# EAGLE design VF_MDS_PCB (EAGLE 9.6.2)
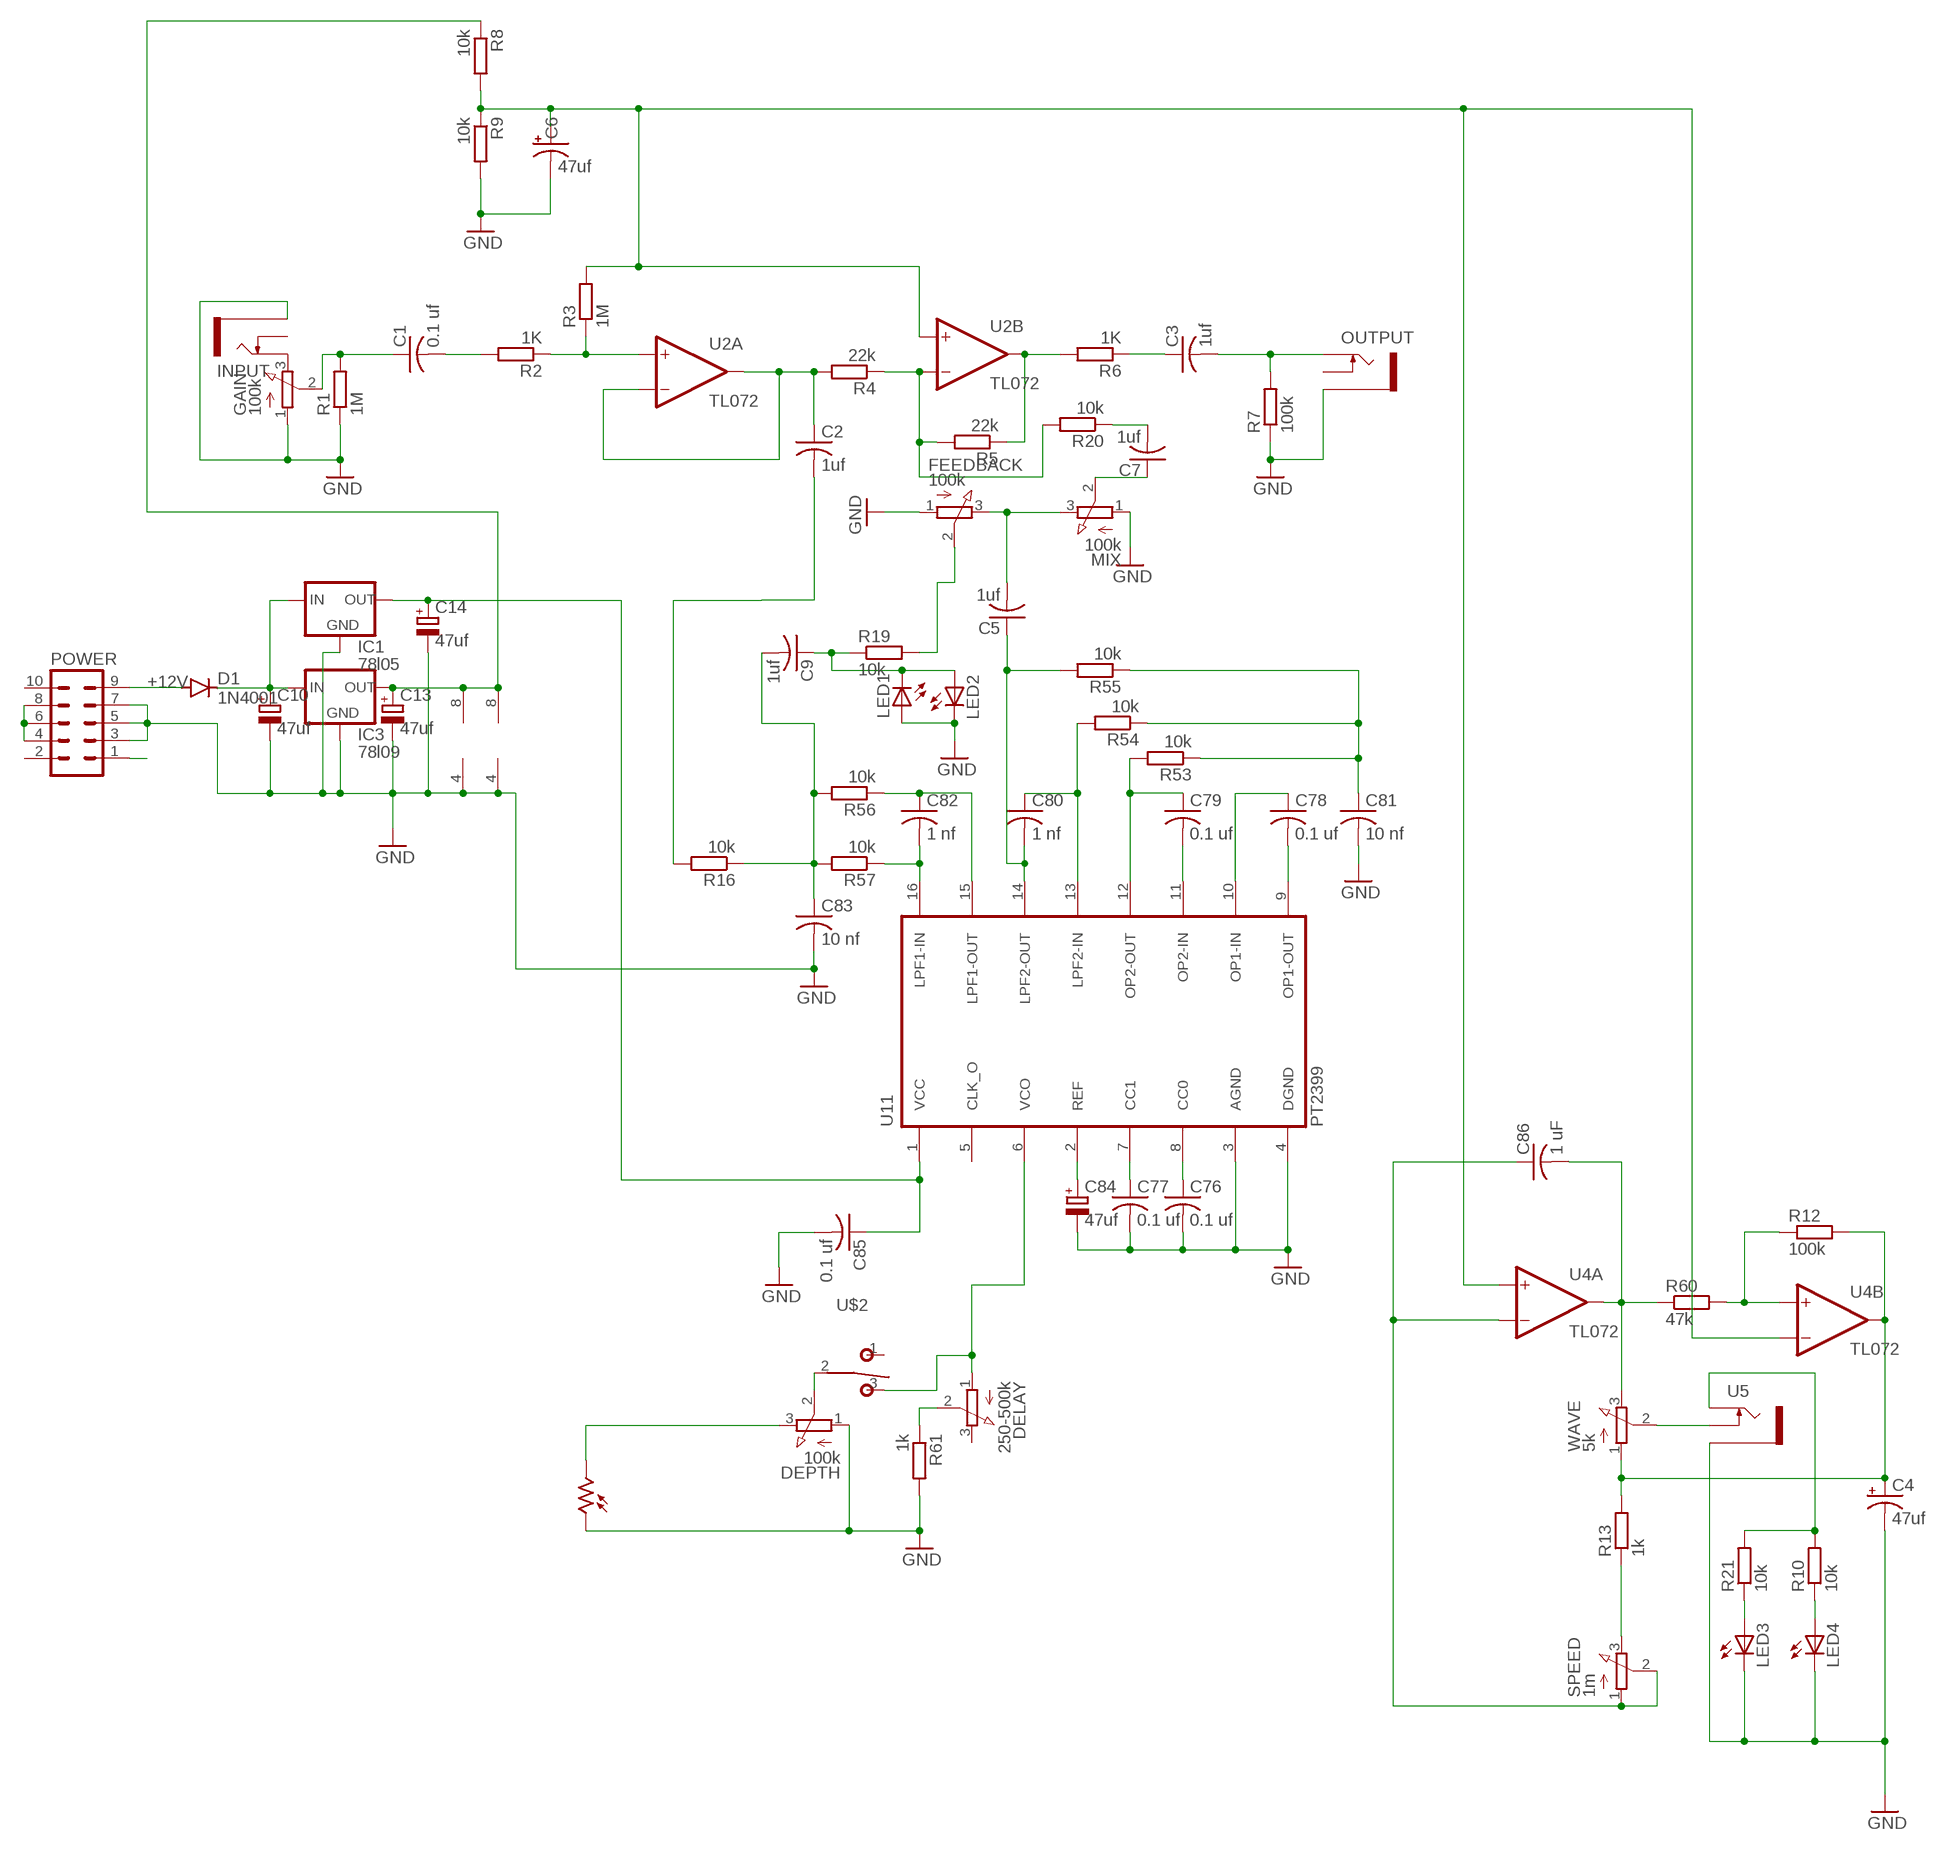
[diagram p0: schematic, sheet 1]

## Parts
C1  0.1 uf  C-US050-025X075  [C050-025X075]
C2  1uf  C-US050-025X075  [C050-025X075]
C3  1uf  C-US050-025X075  [C050-025X075]
C4  47uf  CPOL-USE2,5-6E  [E2,5-6E]
C5  1uf  C-US050-025X075  [C050-025X075]
C6  47uf  CPOL-USE2,5-6E  [E2,5-6E]
C7  1uf  C-US050-025X075  [C050-025X075]
C9  1uf  C-US050-025X075  [C050-025X075]
C10  47uf  CPOL-EUE2,5-6E  [E2,5-6E]
C13  47uf  CPOL-EUE2,5-6E  [E2,5-6E]
C14  47uf  CPOL-EUE2,5-6E  [E2,5-6E]
C76  0.1 uf  C-US050-025X075  [C050-025X075]
C77  0.1 uf  C-US050-025X075  [C050-025X075]
C78  0.1 uf  C-US050-025X075  [C050-025X075]
C79  0.1 uf  C-US050-025X075  [C050-025X075]
C80  1 nf  C-US050-025X075  [C050-025X075]
C81  10 nf  C-US050-025X075  [C050-025X075]
C82  1 nf  C-US050-025X075  [C050-025X075]
C83  10 nf  C-US050-025X075  [C050-025X075]
C84  47uf  CPOL-EUE2,5-6E  [E2,5-6E]
C85  0.1 uf  C-US050-025X075  [C050-025X075]
C86  1 uF  C-US050-025X075  [C050-025X075]
D1  1N4001  1N4004  [DO41-10]
DELAY  250-500k  EVUF2L  [EVUFXL]
DEPTH  100k  EVUF2L  [EVUFXL]
FEEDBACK  100k  EVUF2L  [EVUFXL]
GAIN  100k  EVUF2L  [EVUFXL]
IC1  78l05  78LXX  [78LXX]
IC3  78l09  78LXX  [78LXX]
INPUT  THONKICONNNEW  [WQP-PJ301M-12_JACK]
LED1  LED3MM  [LED3MM]
LED2  LED3MM  [LED3MM]
LED3  LED5MM  [LED5MM]
LED4  LED5MM  [LED5MM]
MIX  100k  EVUF2L  [EVUFXL]
OUTPUT  THONKICONNNEW  [WQP-PJ301M-12_JACK]
PH5  VT90N1  [VT900]
POWER  10_PIN_HEADER  [MA05-2]
R1  1M  RESISTOR7MM  [7MM_RESISTOR]
R2  1K  RESISTOR7MM  [7MM_RESISTOR]
R3  1M  RESISTOR7MM  [7MM_RESISTOR]
R4  22k  RESISTOR7MM  [7MM_RESISTOR]
R5  22k  RESISTOR7MM  [7MM_RESISTOR]
R6  1K  RESISTOR7MM  [7MM_RESISTOR]
R7  100k  RESISTOR7MM  [7MM_RESISTOR]
R8  10k  RESISTOR7MM  [7MM_RESISTOR]
R9  10k  RESISTOR7MM  [7MM_RESISTOR]
R10  10k  RESISTOR7MM  [7MM_RESISTOR]
R12  100k  RESISTOR7MM  [7MM_RESISTOR]
R13  1k  RESISTOR7MM  [7MM_RESISTOR]
R16  10k  RESISTOR7MM  [7MM_RESISTOR]
R19  10k  RESISTOR7MM  [7MM_RESISTOR]
R20  10k  RESISTOR7MM  [7MM_RESISTOR]
R21  10k  RESISTOR7MM  [7MM_RESISTOR]
R53  10k  RESISTOR7MM  [7MM_RESISTOR]
R54  10k  RESISTOR7MM  [7MM_RESISTOR]
R55  10k  RESISTOR7MM  [7MM_RESISTOR]
R56  10k  RESISTOR7MM  [7MM_RESISTOR]
R57  10k  RESISTOR7MM  [7MM_RESISTOR]
R60  47k  RESISTOR7MM  [7MM_RESISTOR]
R61  1k  RESISTOR7MM  [7MM_RESISTOR]
SPEED  1m  EVUF2L  [EVUFXL]
U2  TL072  [DIL08-SML]
U4  TL072  [DIL08-SML]
U5  THONKICONNNEW  [WQP-PJ301M-12_JACK]
U11  PT2399  [DIL16]
U$2  T-80-T-SPDT-ON-OFF-ON  [M9040P]
WAVE  5k  EVUF2L  [EVUFXL]

## Nets
+12V [power]: C10.+ D1.C IC1.IN IC3.IN
-12V [power]: POWER.1
GND: C4.- C6.- C10.- C13.- C14.- C76.2 C77.2 C81.2 C83.2 C84.- C85.2 DEPTH.1(A) FEEDBACK.1(A) GAIN.1(A) IC1.GND IC3.GND INPUT.P$3_SLEEVE(SLEEVE) LED1.A LED2.K(C) LED3.K(C) LED4.K(C) MIX.1(A) OUTPUT.P$3_SLEEVE(SLEEVE) PH5.1 POWER.3 POWER.5 POWER.7 R1.1 R7.1 R9.2 R61.2 U2.4(P:V-) U4.4(P:V-) U5.P$3_SLEEVE(SLEEVE) U11.3(AGND) U11.4(DGND)
GND2: POWER.4 POWER.6 POWER.8
N$1: C1.1 GAIN.2(S) R1.2
N$2: C1.2 R2.2
N$3: R2.1 R3.1 U2.3(A:+IN)
N$4: C2.1 R4.2 U2.1(A:OUT) U2.2(A:-IN)
N$5: R4.1 R5.2 R20.2 U2.6(B:-IN)
N$6: R5.1 R6.2 U2.7(B:OUT)
N$7: C3.2 OUTPUT.P$1_TIP(TIP) R7.2
N$8: C3.1 R6.1
N$9: DELAY.2(S) R61.1
N$10: C6.+ R3.2 R8.2 R9.1 U2.5(B:+IN) U4.3(A:+IN) U4.6(B:-IN)
N$11: DEPTH.2(S) U$2.2(P)
N$12: DEPTH.3(E) PH5.2
N$13: C86.2 R60.1 U4.1(A:OUT) WAVE.3(E)
N$14: R12.1 R60.2 U4.5(B:+IN)
N$15: R13.1 SPEED.3(E)
N$16: C4.+ R12.2 R13.2 U4.7(B:OUT) WAVE.1(A)
N$17: C86.1 SPEED.1(A) SPEED.2(S) U4.2(A:-IN)
N$18: GAIN.3(E) INPUT.P$1_TIP(TIP)
N$19: C5.2 FEEDBACK.3(E) MIX.3(E)
N$20: C7.2 R20.1
N$21: FEEDBACK.2(S) R19.2
N$22: C7.1 MIX.2(S)
N$23: C9.1 LED1.K(C) LED2.A R19.1
N$24: C9.2 C83.1 R16.1 R56.2 R57.2
N$25: U5.P$2_SWITCH(SWITCH) WAVE.2(S)
N$26: R10.2 R21.2 U5.P$1_TIP(TIP)
N$27: C2.2 R16.2
N$28: LED3.A R21.1
N$29: C13.+ IC3.OUT R8.1 U2.8(P:V+) U4.8(P:V+)
N$30: D1.A POWER.9
N$31: LED4.A R10.1
N$32: C14.+ C85.1 IC1.OUT U11.1(VCC)
N$40: DELAY.1(A) U11.6(VCO) U$2.3(S)
N$120: C76.1 U11.8(CC0)
N$121: C77.1 U11.7(CC1)
N$122: C78.2 U11.9(OP1-OUT)
N$123: C78.1 U11.10(OP1-IN)
N$124: C79.2 U11.11(OP2-IN)
N$125: C79.1 R53.2 U11.12(OP2-OUT)
N$126: C5.1 C80.2 R55.2 U11.14(LPF2-OUT)
N$127: C80.1 R54.2 U11.13(LPF2-IN)
N$128: C81.1 R53.1 R54.1 R55.1
N$129: C82.2 R57.1 U11.16(LPF1-IN)
N$130: C82.1 R56.1 U11.15(LPF1-OUT)
N$131: C84.+ U11.2(REF)
Unconnected: DELAY.3(E) INPUT.P$2_SWITCH(SWITCH) OUTPUT.P$2_SWITCH(SWITCH) POWER.2 POWER.10 U11.5(CLK_O) U$2.1(O)

## Library data of the parts
C1-C3 C5 C7 C9 C76-C83 C85 C86 = rcl:C-US: CAPACITOR, American symbol; SPICEPREFIX: C
C4 C6 = rcl:CPOL-US: POLARIZED CAPACITOR, American symbol; SPICEPREFIX: C
C10 C13 C14 C84 = rcl:CPOL-EU: POLARIZED CAPACITOR, European symbol; SPICEPREFIX: C
D1 = diode:1N4004: DIODE general purpose rectifier, 1 A
DELAY DEPTH FEEDBACK GAIN MIX SPEED WAVE = pot:EVU: 9 mm Square Rotary Potentiometers Source: Panasonic
IC1 IC3 = v-reg:78LXX: VOLTAGE REGULATOR
INPUT OUTPUT U5 = MusicThingModular:THONKICONN: 3.5mm socket for Eurorack modular synths
LED1-LED4 = led:LED: LED OSRAM: - CHIPLED LG R971, LG N971, LY N971, LG Q971, LY Q971, LO R971, LY R971 LH N974, LH R974 LS Q976, LO Q976, LY Q976 LO Q996 - Hyper CHIPLED LW Q18S LB Q993, LB Q99A, LB R99A - SideLED LS A670, LO A670, LY A670, LG A670, LP A670 LB A673, LV A673, LT A673, LW A673 LH A674 LY A675 LS A676, LA A676, LO A676, LY A676, LW A676 LS A679, LY A679, LG A679 - Hyper Micro SIDELED® LS Y876, LA Y876, LO Y876, LY Y876 LT Y87S - SmartLED LW L88C, LW L88S LB L89C, LB L89S, LG L890 LS L89K, LO L89K, LY L89K LS L896, LA L896, LO L896, LY L896 - TOPLED LS T670, LO T670, LY T670, LG T670, LP T670 LSG T670, LSP T670, LSY T670, LOP T670, LYG T670 LG T671, LOG T671, LSG T671 LB T673, LV T673, LT T673, LW T673 LH T674 LS T676, LA T676, LO T676, LY T676, LB T676, LH T676, LSB T676, LW T676 LB T67C, LV T67C, LT T67C, LS T67K, LO T67K, LY T67K, LW E67C LS E67B, LA E67B, LO E67B, LY E67B, LB E67C, LV E67C, LT E67C LW T67C LS T679, LY T679, LG T679 LS T770, LO T770, LY T770, LG T770, LP T770 LB T773, LV T773, LT T773, LW T773 LH T774 LS E675, LA E675, LY E675, LS T675 LS T776, LA T776, LO T776, LY T776, LB T776 LHGB T686 LT T68C, LB T68C - Hyper Mini TOPLED® LB M676 - Mini TOPLED Santana® LG M470 LS M47K, LO M47K, LY M47K Source: http://www.osram.convergy.de LUXEON: - LUMILED® LXK2-PW12-R00, LXK2-PW12-S00, LXK2-PW14-U00, LXK2-PW14-V00 LXK2-PM12-R00, LXK2-PM12-S00, LXK2-PM14-U00 LXK2-PE12-Q00, LXK2-PE12-R00, LXK2-PE12-S00, LXK2-PE14-T00, LXK2-PE14-U00 LXK2-PB12-K00, LXK2-PB12-L00, LXK2-PB12-M00, LXK2-PB14-N00, LXK2-PB14-P00, LXK2-PB14-Q00 LXK2-PR12-L00, LXK2-PR12-M00, LXK2-PR14-Q00, LXK2-PR14-R00 LXK2-PD12-Q00, LXK2-PD12-R00, LXK2-PD12-S00 LXK2-PH12-R00, LXK2-PH12-S00 LXK2-PL12-P00, LXK2-PL12-Q00, LXK2-PL12-R00 Source: www.luxeon.com KINGBRIGHT: KA-3528ASYC Source: www.kingbright.com
PH5 = photo-elements:VT9: Photoconductive Cell VT900 Series Source: http://optoelectronics.perkinelmer.com/content/Datasheets/DTS_vt900seriesdatasheet.pdf
POWER = TomW:10_PIN_HEADER: PIN HEADER; OC_FARNELL: unknown; OC_NEWARK: unknown
R1-R10 R12 R13 R16 R19-R21 R53-R57 R60 R61 = MusicThingModular:RESISTOR: Standard resistor, various versions
U2 U4 = MusicThingModular:TL072: Generic Dual Op Amp
U11 = princeton-tech:PT2399: Echo Processor IC
U$2 = MusicThingModular:T-80-T-SPDT-ON-OFF-ON

## Net classes
1 power: width 0.61 mm

## Board
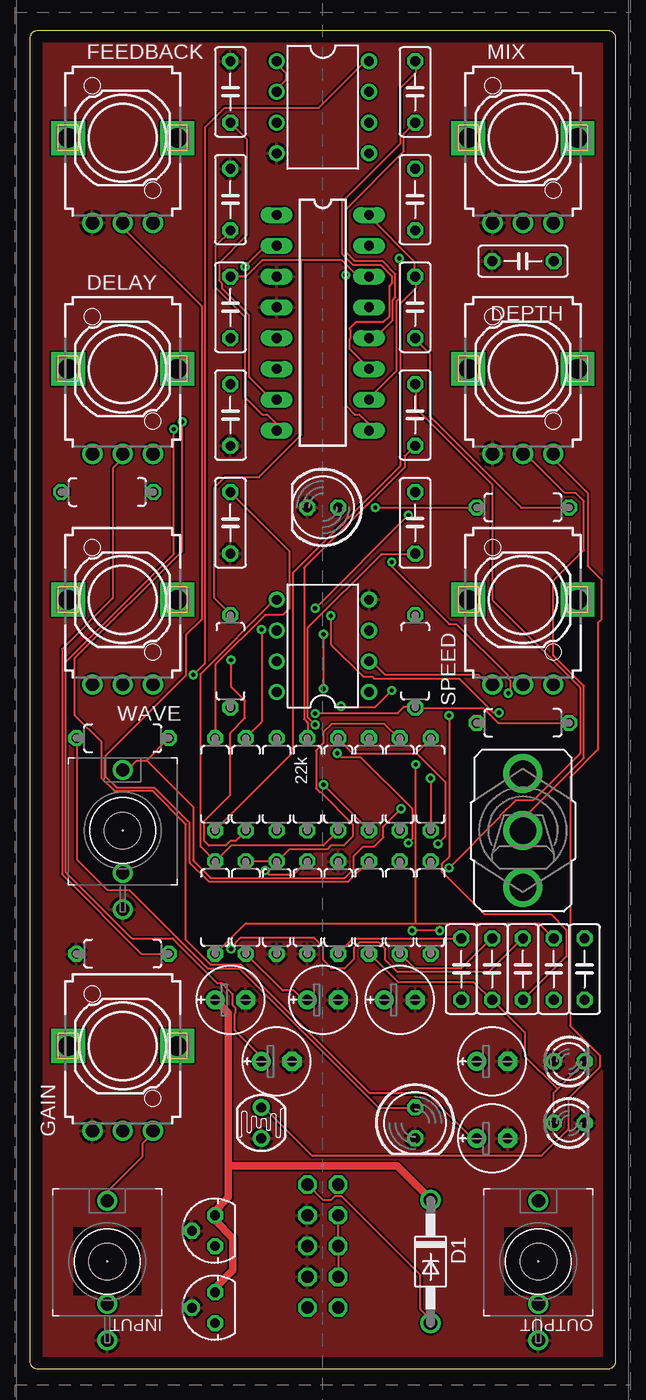
[diagram p1: board, top side]
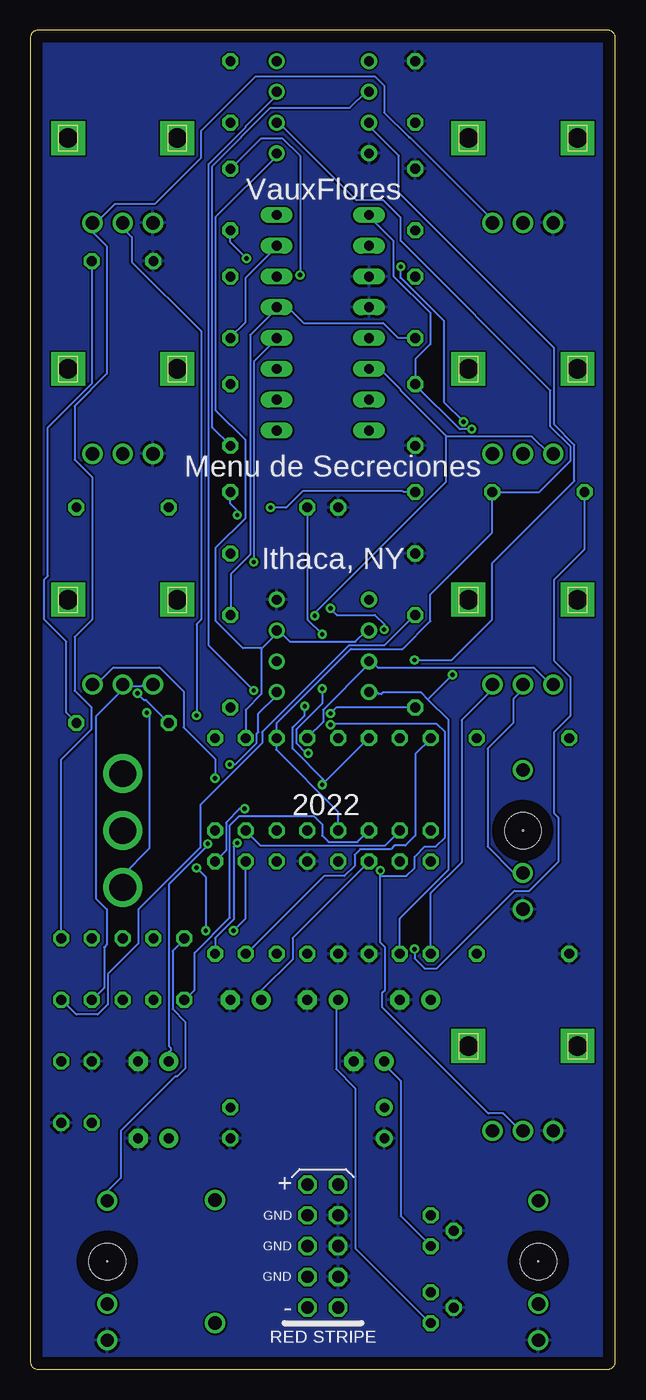
[diagram p2: board, bottom side, seen from below]

Size 48.26 x 110.49 mm. Coordinates in mm from the lower left corner, seen from the top.
Copper layers (1*16): Top 0.035mm / dielectric 1.5mm / Bottom 0.035mm
Design rules "default": minimum track width 6mil, minimum drill 0.35mm, track to track 6mil, track to pad 6mil, pad to pad 6mil, via to via 6mil, smd to smd 6mil, copper to edge 40mil, drill to drill 6mil, minimum pad ring 10mil, minimum via ring 8mil, stop-mask expansion 4mil, vias tented up to drill 0mil, thermal gap 10mil
Holes 0.08 mm at 7.62,44.45 41.91,8.89 6.35,8.89
Holes 3 mm at 6.35,8.89 41.91,8.89 7.62,44.45

### Footprints (pad centres in the part's own frame; a part is rotated, then mirrored left to right if it is on the bottom)
C050-025X075 = drill 0.813 octagon: 1 -2.54,0; 2 2.54,0
E2,5-6E = drill 0.813 pad 1.575: + -1.27,0 | drill 0.813 pad 1.575 octagon: - 1.27,0
DO41-10 = drill 1.118: A 5.08,0; C -5.08,0
EVUFXL = drill 1.1 pad 1.676: 1 -2.5,-7; 2 0,-7; 3 2.5,-7 | drill 1.6 pad 2.8 square: M1 4.5,0; M2 -4.5,0
78LXX = drill 0.813 octagon: GND 0,1.905; IN 1.27,0; OUT -1.27,0
WQP-PJ301M-12_JACK = drill 1.1: P$1_TIP 0,5; P$2_SWITCH 0,-3.5; P$3_SLEEVE 0,-6.5
LED3MM = drill 0.813 octagon: A -1.27,0; K 1.27,0
LED5MM = drill 0.813 octagon: A -1.27,0; K 1.27,0
VT900 = drill 0.8 pad 1.4: 1 -1.27,0; 2 1.27,0
MA05-2 = drill 1.016 octagon: 1 -5.08,-1.27; 2 -5.08,1.27; 3 -2.54,-1.27; 4 -2.54,1.27; 5 0,-1.27; 6 0,1.27; 7 2.54,-1.27; 8 2.54,1.27; 9 5.08,-1.27; 10 5.08,1.27
7MM_RESISTOR = drill 0.813 octagon: 1 -3.81,0; 2 3.81,0
DIL08-SML = drill 0.813 pad 1.27: 1 -3.81,-3.81; 2 -1.27,-3.81; 3 1.27,-3.81; 4 3.81,-3.81; 5 3.81,3.81; 6 1.27,3.81; 7 -1.27,3.81; 8 -3.81,3.81
DIL16 = drill 0.813 long: 1 -8.89,-3.81; 2 -6.35,-3.81; 3 -3.81,-3.81; 4 -1.27,-3.81; 5 1.27,-3.81; 6 3.81,-3.81; 7 6.35,-3.81; 8 8.89,-3.81; 9 8.89,3.81; 10 6.35,3.81; 11 3.81,3.81; 12 1.27,3.81; 13 -1.27,3.81; 14 -3.81,3.81; 15 -6.35,3.81; 16 -8.89,3.81
M9040P = drill 2.2: 1 0,4.699 | drill 2.2 pad 3: 2 0,0; 3 0,-4.699

### Placement (x,y rotation side)
C1  31.75,69.85 90 top
C2  31.75,78.74 90 top
C3  35.56,33.02 90 top
C4  38.1,25.4 0 top
C5  45.72,33.02 90 top
C6  30.48,30.48 0 top
C7  40.64,33.02 90 top
C9  38.1,33.02 90 top
C10  16.51,30.48 0 top
C13  24.13,30.48 0 top
C14  20.32,25.4 0 top
C76  16.51,96.52 90 top
C77  16.51,105.41 90 top
C78  31.75,96.52 90 top
C79  31.75,105.41 90 top
C80  16.51,87.63 90 top
C81  40.64,91.44 180 top
C82  31.75,87.63 90 top
C83  16.51,69.85 270 top
C84  38.1,19.05 0 top
C85  16.51,78.74 270 top
C86  43.18,33.02 90 top
D1  33.02,8.89 270 top
DELAY  7.62,82.55 0 top
DEPTH  40.64,82.55 0 top
FEEDBACK  7.62,101.6 0 top
GAIN  7.62,26.67 0 top
IC1  15.24,11.43 90 top
IC3  15.24,5.08 90 top
INPUT  6.35,8.89 0 top
LED1  44.45,25.4 0 top
LED2  44.45,20.32 0 top
LED3  31.75,20.32 270 top
LED4  24.13,71.12 180 top
MIX  40.64,101.6 0 top
OUTPUT  41.91,8.89 0 top
PH5  19.05,20.32 90 top
POWER  24.13,10.16 90 bottom
R1  22.86,38.1 90 top
R2  17.78,48.26 90 top
R3  30.48,48.26 90 top
R4  22.86,48.26 90 top
R5  27.94,48.26 90 top
R6  20.32,48.26 90 top
R7  25.4,38.1 270 top
R8  17.78,38.1 90 top
R9  20.32,38.1 270 top
R10  33.02,38.1 90 top
R12  25.4,48.26 90 top
R13  33.02,48.26 90 top
R16  30.48,38.1 90 top
R19  27.94,38.1 90 top
R20  6.35,72.39 0 top
R21  7.62,52.07 0 top
R53  40.64,53.34 180 top
R54  31.75,58.42 90 top
R55  16.51,58.42 90 top
R56  40.64,71.12 180 top
R57  15.24,48.26 90 top
R60  15.24,38.1 90 top
R61  7.62,34.29 180 top
SPEED  40.64,63.5 0 top
U2  24.13,104.14 270 top
U4  24.13,59.69 90 top
U5  7.62,44.45 0 top
U11  24.13,86.36 270 top
U$1  [EURO_PCB_10HP]  -1.27,-8.89 0 top  (outside the outline)
U$2  40.64,44.45 0 top
WAVE  7.62,63.5 0 top

### Tracks (layer width: path | path; a pad name or v marks a point on that pad's centre or on a via)
+12V
  Top 0.61: IC3.IN 15.27,6.4 15.27,6.71 16.71,8.15 16.71,10.82 15.27,12.27 15.27,12.65 IC1.IN 15.11,12.95 16.33,14.17 16.33,16.76 | 16.33,16.76 16.33,29.41 15.27,30.48 C10.+ | 16.33,16.76 30.28,16.76 33.02,14.02 D1.C
GND
  pour Top: 0,110.49 49.53,110.49 49.53,-1.27 -1.27,-1.27 -1.27,110.49
  pour Bottom: 0,110.49 48.26,110.49 48.26,0 0,0
GND2
  Top 0.152: POWER.4 POWER.6 POWER.8
N$1  (via drill 0.35)
  Top 0.152: v19.38,41.15 19.68,40.84 21.74,40.84 22.81,41.91 R1.2 | v23.5,53.19 22.89,53.8 22.89,61.19 28.98,67.28 31.72,67.28 C1.1
  Bottom 0.152: 19.38,40.69 19.38,35.2 19,34.82 19,31.32 19.23,31.09 19.23,29.87 10.46,21.11 9.25,21.11 7.87,19.74 7.64,19.74 GAIN.2 | 19.38,40.69 v19.38,41.15 | v23.5,53.19 23.42,53.26 14.73,53.26 14.05,52.58 14.05,43.89 14.81,43.13 15.72,43.13 16.56,42.29 16.56,41.38 17.25,40.69 19.38,40.69
N$2  (via drill 0.35)
  Top 0.152: v19.07,61.04 19.07,53.42 17.78,52.12 R2.2 | v31.19,70.48 v23.5,62.79
  Bottom 0.152: v19.07,61.04 19.07,61.49 19.84,62.26 22.96,62.26 v23.5,62.79 | v31.19,70.48 31.19,70.87 31.8,71.48 31.8,72.39 C1.2
N$3  (via drill 0.35)
  Top 0.152: v16.56,58.52 16.56,56.31 17.7,55.17 17.7,53.72 16.48,52.5 16.48,47.4 14.35,45.26 14.35,43.59 14.73,43.2 16.1,43.2 16.48,43.59 16.94,43.59 17.78,44.42 R2.1
  Bottom 0.152: R2.1 17.78,44.42 19,43.2 29.29,43.2 30.5,44.42 R3.1 | v16.56,58.52 13.51,58.52 10.16,61.87 10.16,66.52 3.38,73.3 3.38,76.28 5.05,77.95 5.05,84.28 17.86,97.08 17.86,100.13 20.3,102.56 20.3,102.87 U2.3
N$4
  Top 0.152: U2.2 20.37,105.46 20.37,105.69 21.06,106.38 21.06,106.98 20.37,107.67 20.37,107.9 U2.1 | R4.2 22.89,52.12 22.89,53.34 22.58,53.65 22.58,66.14 30.89,74.45 30.89,75.36 31.72,76.2 C2.1
  Bottom 0.152: U2.2 20.37,105.39 20.6,105.39 21.89,104.09 28.45,104.09 33.25,99.29 33.25,77.72 31.72,76.2 C2.1
N$5
  Bottom 0.152: R4.1 22.89,44.5 22.89,46.02 27.99,51.13 27.99,52.05 R5.2 27.91,52.12 27.91,53.34 21.82,59.44 17.55,59.44 15.27,61.72 15.27,63.93 10.16,69.04 R20.2 6.27,72.39 3.68,74.98 3.68,76.12 5.36,77.8 5.36,80.77 17.7,93.12 17.7,95.02 19.15,96.47 21.36,96.47 27.76,102.87 U2.6
N$6  (via drill 0.35)
  Top 0.152: v24.18,48.23 27.91,44.5 R5.1 | v29.82,56.01 28.45,54.63 25.71,54.63 v25.63,54.71
  Bottom 0.152: R6.2 20.37,52.05 v24.18,48.23 23.95,48.54 26.62,51.21 26.62,52.96 25.63,53.95 v25.63,54.71 | v29.82,56.01 33.55,59.74 33.55,99.44 30.5,102.49 30.5,102.56 27.99,105.08 27.99,105.39 U2.7
N$7
  Top 0.152: R7.2 26.62,35.51 35.53,35.51 C3.2
  Bottom 0.152: OUTPUT.P$1_TIP 41.86,13.95 41.86,14.71 40.79,15.77 40.79,19.66 36.3,24.16 36.14,24.16 35.46,24.84 35.46,28.65 36.52,29.72 36.52,34.52 35.53,35.51 C3.2
N$8
  Bottom 0.152: R6.1 20.37,44.42 21.29,43.51 23.65,43.51 24.18,44.04 24.18,44.96 24.87,45.64 31.04,45.64 31.8,44.88 31.8,37.26 34.7,34.37 34.7,31.32 35.53,30.48 C3.1
N$9
  Top 0.152: R61.1 9.17,34.29 2.62,40.84 2.62,59.44 6.81,63.63 6.81,74.37 7.57,75.13 7.57,75.51 DELAY.2
N$10
  Top 0.152: R8.2 R9.1 20.37,41.91 21.36,42.9 24.49,42.9 24.79,43.2 25.86,43.2 26.62,43.97 26.62,44.96 23.95,47.62 23.88,47.62 23.57,47.93 23.57,51.05 24.18,51.66 24.18,52.58 24.87,53.26 29.21,53.26 30.43,52.05 R3.2
  Bottom 0.152: C6.+ 29.21,31.24 26.62,33.83 26.62,35.59 20.3,41.91 R9.1 | U4.6 20.52,60.96 21.44,60.05 26.85,60.05 27.76,60.96 U4.3 27.76,60.88 29.17,59.47 | 29.17,59.47 29.21,59.44 29.21,55.7 30.5,54.41 30.5,52.12 R3.2 | U2.5 27.99,100.28 27.99,100.05 32.94,95.1 32.94,79.1 30.5,76.66 30.5,70.26 32.94,67.82 32.94,61.72 30.73,59.51 29.21,59.51 29.17,59.47
N$11
  Top 0.152: U$2.2 40.64,45.41 45.67,50.44 45.67,56.39 43.15,58.9 43.15,65.08 45.67,67.59 45.67,71.63 44.98,72.31 44.07,72.31 40.87,75.51 40.64,75.51 DEPTH.2
N$12
  Top 0.152: PH5.2 19.07,21.57 19.3,21.57 23.27,17.6 42.16,17.6 44.37,19.81 44.37,22.33 46.96,24.92 46.96,25.91 44.53,28.35 44.53,48.84 46.81,51.13 46.81,61.57 47.12,61.87 47.12,65.15 45.97,66.29 45.97,72.31 43.15,75.13 43.15,75.51 DEPTH.3
N$13  (via drill 0.35)
  Top 0.152: C86.2 41.93,36.8 31.8,36.8 | 31.8,36.8 17.78,36.8 15.27,34.29 R60.1 | 31.8,36.8 v31.8,49.91
  Bottom 0.152: R60.1 15.27,34.29 15.27,39.24 12.68,41.83 12.68,53.57 10.16,56.08 10.16,56.46 WAVE.3 | v31.8,49.91 31.34,49.91 29.59,51.66 29.59,52.43 29.44,52.58 29.44,54.1 27.99,55.55 27.99,55.85 U4.1
N$14
  Top 0.152: 15.27,41.91 16.56,43.2 24.18,43.2 25.4,44.42 R12.1 | 15.27,41.91 14.05,43.13 14.05,57.38 20.14,63.48 20.3,63.48 U4.5 | 15.27,41.91 R60.2
N$15  (via drill 0.35)
  Top 0.152: v33.02,48.77 R13.1
  Bottom 0.152: v33.02,48.77 33.02,50.37 35.61,52.96 35.61,55.93 37.59,57.91 41.4,57.91 42.77,56.54 43.08,56.54 SPEED.3
N$16  (via drill 0.35)
  Top 0.152: 31.84,50.86 31.8,50.83 26.62,50.83 25.4,52.05 R12.2 | 31.84,50.86 33.02,52.05 R13.2 | v33.63,43.36 34.24,43.97 34.24,48.46 31.84,50.86
  Bottom 0.152: 20.37,58.14 24.11,54.41 24.11,53.42 25.4,52.12 R12.2 | 20.37,58.14 20.37,58.37 U4.7 20.37,58.14 | C4.+ 36.83,26.14 36.68,26.29 36.68,26.52 36.83,26.67 36.83,40.01 33.63,43.2 v33.63,43.36 | 20.37,58.14 19.84,58.14 19.61,57.91 6.73,57.91 5.36,56.54 5.13,56.54 WAVE.1
N$17
  Top 0.152: U4.2 27.99,58.37 28.22,58.37 29.29,57.3 36.98,57.3 37.74,56.54 38.12,56.54 SPEED.1
  Bottom 0.152: 40.64,56.39 SPEED.2 40.64,56.46 | 40.64,56.39 40.64,56.08 42.85,53.87 42.85,38.86 41.93,37.95 41.93,35.05 42.16,34.82 42.16,31.47 43.15,30.48 C86.1 | 40.64,56.39 39.04,56.39 38.96,56.46 38.2,56.46 SPEED.1
N$18
  Top 0.152: INPUT.P$1_TIP 6.35,14.63 9.25,17.53 9.25,18.59 10.08,19.43 10.08,19.66 GAIN.3
N$19
  Bottom 0.152: C5.2 45.74,35.59 45.74,50.29 43.23,52.81 43.23,54.63 44.6,56.01 44.6,60.43 43.15,61.87 43.15,73.61 44.6,75.06 44.6,79.48 41.93,82.14 41.93,92.66 43.08,93.8 43.08,94.56 MIX.3 43,94.56 42.85,94.56 41.25,96.16 37.97,96.16 34.16,99.97 34.16,102.18 29.67,106.68 19.84,106.68 19.07,105.92 19.07,103.71 17.02,101.65 16.94,101.65 10.16,94.87 10.16,94.64 FEEDBACK.3
N$20  (via drill 0.35)
  Top 0.152: v16.56,34.67 16.56,34.82 17.32,35.59 23.42,35.59 24.18,34.82 24.18,33.76 24.87,33.07 25.93,33.07 26.7,33.83 26.7,34.75 27.15,35.2 28.75,35.2 29.29,34.67 29.29,33.76 30.28,32.77 37.82,32.77 40.64,35.59 C7.2
  Bottom 0.152: R20.1 2.54,67.67 5.05,65.15 5.05,58.45 3.68,57.07 3.68,53.95 5.05,52.58 5.05,45.87 4.67,45.49 4.67,41.91 7.11,39.47 8.33,39.47 14.73,33.07 15.72,33.07 16.56,33.91 v16.56,34.67
N$21
  Top 0.152: R19.2 27.91,41.91 26.24,40.23 14.73,40.23 13.13,41.83 13.13,45.11 10.24,48.01 7.11,48.01 6.2,48.92 6.2,50.6 12.83,57.23 12.83,60.58 14.12,61.87 14.12,87.71 7.64,94.18 7.64,94.56 FEEDBACK.2
N$22  (via drill 0.35)
  Top 0.152: C7.1 44.22,34.06 44.22,36.27 42.93,37.57 37.44,37.57 33.93,41.07 33.93,41.68 34.54,42.29 v34.54,53.95
  Bottom 0.152: v34.54,53.95 34.54,61.49 34.16,61.87 34.16,85.65 39.88,91.36 39.88,93.42 40.64,94.18 MIX.2
N$23
  Top 0.152: 43.5,23.13 45.74,25.38 LED1.K | 43.5,23.13 43.15,22.78 43.15,20.34 LED2.A | R19.1 27.99,34.29 30.35,31.93 36.6,31.93 38.05,30.48 C9.1 38.12,30.48 40.79,27.81 40.79,25.83 43.5,23.13
N$24  (via drill 0.35)
  Top 0.152: R16.1 30.5,34.29 31.72,33.07 35.53,33.07 38.05,35.59 C9.2 | R57.2 15.27,52.12 15.27,58.14 19.38,62.26 20.83,62.26 21.36,62.79 21.36,67.51 16.48,72.39 C83.1 | v28.45,71.09 36.83,71.09 R56.2
  Bottom 0.152: v28.45,71.09 27.15,71.09 25.78,72.47 17.55,72.47 17.48,72.39 C83.1 | R16.1 30.43,34.29 24.03,40.69 22.35,40.69 21.51,41.53 21.51,42.44 21.06,42.9 18.54,42.9 18.24,43.2 17.32,43.2 16.48,44.04 16.48,50.75 15.19,52.05 R57.2
N$25
  Bottom 0.152: U5.P$2_SWITCH 7.64,41 8.41,41 10.54,43.13 10.54,51.21 8.41,53.34 8.41,55.32 7.64,56.08 7.64,56.46 WAVE.2
N$26  (via drill 0.35)
  Top 0.152: 9.59,50.25 9.55,50.22 8.79,50.22 8.03,49.45 7.64,49.45 U5.P$1_TIP | 9.59,50.25 11.38,52.05 R21.2 | v30.58,46.25 29.13,44.81 29.13,43.89 28.37,43.13 27.46,43.13 26.7,42.37 26.7,41.3 25.93,40.54 14.88,40.54 13.44,41.99 13.44,46.41 9.59,50.25
  Bottom 0.152: R10.2 32.11,42.82 32.11,45.11 30.96,46.25 v30.58,46.25
N$27  (via drill 0.35)
  Top 0.152: v33.78,36.2 v31.5,36.2 | v34.54,41.38 38.73,45.57 38.73,45.64 40.03,46.94 41.48,46.94 45.36,50.83 45.36,56.24 38.12,63.48 38.12,73 31.8,79.32 31.8,81.23 C2.2
  Bottom 0.152: v31.5,36.2 30.5,37.19 30.5,41.91 R16.2 | v33.78,36.2 33.78,40.62 v34.54,41.38
N$28
  Top 0.152: LED3.A 31.72,21.57 28.75,21.57 17.25,33.07 14.66,33.07 8.18,39.55 6.35,39.55 3.84,42.06 3.84,52.05 R21.1
N$29  (via drill 0.35)
  Top 0.152: R8.1 20.83,31.24 21.74,31.24 22.5,30.48 C13.+ | v13.44,57.3 14.43,58.29 14.43,102.49 16.03,104.09 23.8,104.09 27.61,107.9 27.91,107.9 U2.8
  Bottom 0.152: IC3.OUT 15.27,3.81 21.44,9.98 21.44,23.16 23.04,24.77 23.04,30.33 22.89,30.48 C13.+ | 15.46,55.28 13.74,53.57 13.74,41.22 17.78,37.19 R8.1 | 15.46,55.28 16.03,55.85 19.15,55.85 19.3,55.7 19.53,55.7 19.68,55.85 20.3,55.85 U4.8 | 15.46,55.28 v13.44,57.3
N$30
  Top 0.152: D1.A 33.02,4.12 32.18,4.95 32.18,7.77 25.71,14.25 25.09,14.25 24.79,13.95 24.18,13.95 22.89,15.24 POWER.9
N$31  (via drill 0.35)
  Top 0.152: v31.19,43.43 31.5,43.74 31.5,46.25 27.23,50.52 25.63,50.52 v25.32,50.83 | v24.18,60.66 v24.18,56.16
  Bottom 0.152: R10.1 33.02,35.59 31.5,37.11 31.5,43.13 v31.19,43.43 | v25.32,50.83 25.48,50.83 26.31,51.66 26.31,52.81 24.18,54.94 v24.18,56.16 | v24.18,60.66 25.4,61.87 LED4.A
N$32  (via drill 0.35)
  Top 0.152: v11.84,77.57 11.84,67.28 2.92,58.37 2.92,41 8.41,35.51 11.76,35.51 15.42,31.85 15.8,31.85 16.71,30.94 16.71,30.02 16.94,29.79 16.94,29.41 16.87,29.34 16.87,27.96 19,25.83 19,25.45 C14.+
  Bottom 0.152: U11.1 20.3,95.25 20.3,95.1 18.31,93.12 18.31,90.22 15.27,87.17 15.27,84.58 16.48,83.36 16.48,81.31 C85.1 16.48,81.23 12.83,77.57 v11.84,77.57 | IC1.OUT 15.27,10.21 17.7,12.65 17.7,23.77 19,25.07 19,25.38 C14.+
N$40  (via drill 0.35)
  Top 0.152: v38.66,54.18 38.2,54.18 35.38,57 28.37,57 28.22,57.15 27.46,57.15 24.79,59.82 v24.79,62.18
  Bottom 0.152: 13.93,77 13.89,76.96 6.88,76.96 5.51,75.59 5.13,75.59 DELAY.1 | 13.93,77 17.7,80.77 17.7,80.85 19.38,82.53 20.3,82.53 U11.6 | U$2.3 40.64,40.77 38.43,42.98 38.43,53.95 v38.66,54.18 | v24.79,62.18 24.79,62.41 13.97,73.23 13.97,76.96 13.93,77
N$120
  Top 0.152: U11.8 20.3,77.5 20.3,78.03 19.53,78.79 19.15,78.79 17.7,80.24 17.7,86.87 15.27,89.31 15.27,92.66 16.56,93.95 C76.1
N$121
  Top 0.152: U11.7 19.91,80.01 18.01,81.92 18.01,87.02 15.8,89.23 15.8,89.61 15.57,89.84 15.57,91.29 17.86,93.57 17.86,101.5 16.48,102.87 C77.1
N$122  (via drill 0.35)
  Top 0.152: v26.01,90.3 26.01,79.55 26.77,78.79 27.15,78.79 27.91,78.03 27.91,77.5 U11.9
  Bottom 0.152: v26.01,90.3 26.01,100.13 27.46,101.58 29.21,101.58 31.72,99.06 C78.2
N$123  (via drill 0.35)
  Top 0.152: v30.43,91.67 30.43,88.32 30.2,88.09 30.2,82.37 27.99,80.16 27.99,80.01 U11.10
  Bottom 0.152: v30.43,91.67 31.8,93.04 31.8,93.95 C78.1
N$124
  Top 0.152: U11.11 27.91,82.6 26.31,84.2 26.31,84.96 26.39,85.04 26.39,85.8 26.31,85.88 26.85,86.41 29.13,86.41 29.59,86.87 29.59,89.38 29.82,89.61 29.82,90.22 28.91,91.14 26.62,91.14 25.71,92.05 25.71,96.32 30.5,101.12 30.5,105.69 31.8,106.98 31.8,107.9 C79.2
N$125  (via drill 0.35)
  Top 0.152: v39.42,55.78 39.42,56.01 39.57,56.16 39.57,56.84 39.42,57 39.42,57.23 35.15,61.49 34.54,61.49 29.82,66.22 v29.82,66.6 | C79.1 31.72,102.87 30.81,101.96 30.81,100.51 26.01,95.71 26.01,92.2 26.77,91.44 29.06,91.44 30.12,90.37 30.12,88.47 29.9,88.24 29.9,86.56 28.45,85.11 27.99,85.11 U11.12
  Bottom 0.152: R53.2 38.73,55.24 38.89,55.24 v39.42,55.78 | v29.82,66.6 29.82,83.13 27.91,85.04 U11.12
N$126
  Top 0.152: 22.35,91.52 25.71,91.52 27,90.22 27.91,90.22 U11.14 | 22.35,91.52 19.15,91.52 17.78,90.14 16.56,90.14 C80.2 | 22.35,91.52 22.35,77.11 18.85,73.61 16.03,73.61 15.19,72.77 15.19,63.63 16.56,62.26 R55.2
  Bottom 0.152: C5.1 45.67,30.48 44.45,29.26 42.7,29.26 41.86,30.1 41.86,32.61 39.34,35.13 39.34,37.95 34.24,43.05 34.24,46.56 29.13,51.66 29.13,52.58 21.97,59.74 19.07,59.74 16.56,62.26 R55.2
N$127
  Bottom 0.152: R54.2 31.72,62.26 31.72,65.61 30.12,67.21 30.12,85.34 27.99,87.48 27.99,87.63 U11.13 27.99,87.4 26.77,87.4 25.71,86.33 19.15,86.33 17.93,85.11 16.56,85.11 C80.1
N$128  (via drill 0.35)
  Top 0.152: v23.5,54.1 30.28,54.1 30.81,54.63 31.72,54.63 R54.1 31.8,54.56 37.36,54.56 38.58,53.34 R53.1
  Bottom 0.152: v23.5,54.1 22.96,54.63 16.56,54.63 R55.1 | R53.1 45.29,54.18 45.29,60.05 47.12,61.87 47.12,65.15 46.81,65.46 46.81,77.72 43.15,81.38 43.15,91.44 C81.1
N$129
  Top 0.152: R57.1 15.27,44.5 21.67,50.9 21.67,65.68 30.5,74.52 30.5,87.94 31.8,89.23 31.8,90.14 C82.2 31.72,90.22 31.72,91.36 27.99,95.1 27.99,95.25 U11.16
N$130
  Top 0.152: R56.1 44.45,71.09 40.49,71.09 32.94,78.64 32.94,83.82 31.72,85.04 C82.1
  Bottom 0.152: U11.15 28.52,92.13 28.52,92.05 30.5,90.07 30.5,86.41 31.8,85.11 C82.1
N$131  (via drill 0.35)
  Top 0.152: v17.7,90.98 19.38,92.66 20.3,92.66 U11.2 | v12.52,78.18 12.52,67.51 3.68,58.67 3.68,53.95 5.89,51.74 5.89,48.77 6.96,47.7 10.08,47.7 12.83,44.96 12.83,35.43 14.88,33.38 17.4,33.38 27.99,22.78 32.71,22.78 36.45,19.05 C84.+
  Bottom 0.152: v17.7,90.98 17.7,90.07 14.12,86.49 14.12,79.78 v12.52,78.18

### Text on the board
tPlace: 22k
bNames: VauxFlores | Menu de Secreciones | Ithaca, NY | 2022